# Altium schematic sheet supply0.SchDoc: foxBMS BMS-Master
size A3; DocumentNumber: 2; SheetNumber: 2; SheetTotal: 24; Author: Fraunhofer IISB foxBMS Team; REL-DATE: 2017-05-16; VERSION: 1.0.2; SheetDescription: Supply for MCU0 and peripherals
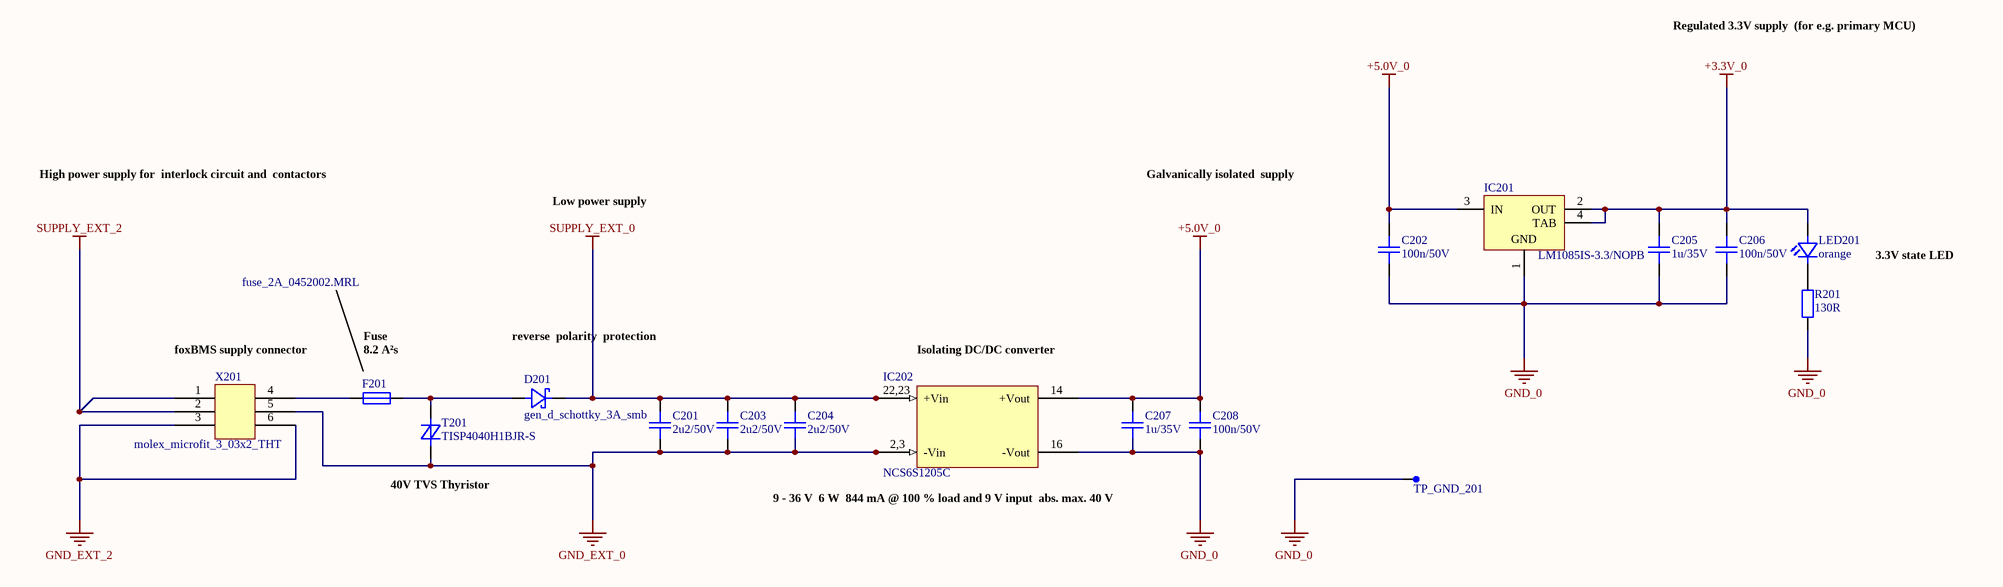
[diagram p0: supply0.SchDoc]

## Parts
C201  2u2/50V  [CAPC2012X14N]
C202  100n/50V  [CAPC1608X08N]
C203  2u2/50V  [CAPC2012X14N]
C204  2u2/50V  [CAPC2012X14N]
C205  1u/35V  [CAPC1608X08N]
C206  100n/50V  [CAPC1608X08N]
C207  1u/35V  [CAPC1608X08N]
C208  100n/50V  [CAPC1608X08N]
D201  gen_d_schottky_3A_smb  [SMB]
F201  fuse_2A_0452002.MRL  [LITTLEFUSE_452_454]
IC201  LM1085IS-3.3/NOPB  [KTT0003B_N]
IC202  NCS6S1205C  [NCS6S1205C]
LED201  orange  [LEDC1608X07N]
R201  130R  [RESC1608X05N]
T201  TISP4040H1BJR-S  [SMB]
TP_GND_201  Testpoint_Round  [Testpoint_D1V]  (value not drawn)  (no BOM)
X201  molex_microfit_3_03x2_THT  [MOLEX_MICROFIT_03x2_THT]

## Nets
+3.3V_0: C205.1 C206.1 IC201.2(OUT) IC201.4(TAB) LED201.2(A)
+5.0V_0: C202.1 C207.1 C208.1 IC201.3(IN) IC202.14(+Vout)
GND_0: C202.2 C205.2 C206.2 C207.2 C208.2 IC201.1(GND) IC202.16(-Vout) R201.1 TP_GND_201.1
GND_EXT_0: C201.2 C203.2 C204.2 IC202.2(-Vin) IC202.3(-Vin) T201.2(T(A)) X201.5
GND_EXT_2: X201.3 X201.6
SUPPLY_EXT_0: C201.1 C203.1 C204.1 D201.1(K) IC202.22(+Vin) IC202.23(+Vin)
SUPPLY_EXT_2: X201.1 X201.2
NetD201_2: D201.2(A) F201.2 T201.1(R(B))
NetF201_1: F201.1 X201.4
NetLED201_1: LED201.1(C) R201.2

## Notes on the sheet
- Regulated 3.3V supply
  (for e.g. primary MCU)
- High power supply for
  interlock circuit and
  contactors
- Galvanically isolated
  supply
- Low power supply
- 3.3V state LED
- foxBMS supply connector
- Fuse
- (near F201) 8.2 A²s
- reverse
  polarity
  protection
- (near IC202) Isolating DC/DC converter
- (near T201) 40V TVS Thyristor
- 9 - 36 V
  6 W
  844 mA @ 100 % load and 9 V input
  abs. max. 40 V
- Fraunhofer IISB
- Schottkystr. 10
- developed by:
- 91058 Erlangen
- Germany
- Author
- Project
- License
- Description
- File
- Version
- Release Date
- Sheet
- www.foxbms.org
- www.iisb.fraunhofer.de
- foxBMS Team
- /
- (in symbol NCS6S1205C) 22,23; 2,3

## Library data of the parts
C201 C203 C204 = gen_C_ceramic_2u2_50V_X7R_0805: MLCC; Capacitance: 2u2; Rated Voltage: 50V; Dielectric: X7R; Case EIA: 0805; Case Metric: 2012; Automotive Qualified: False; Part Number: gen_C_ceramic_2u2_50V_X7R_0805; Supplier 1: Farnell; Supplier Part Number 1: 2547054
C202 C206 C208 = gen_C_ceramic_100n_50V_X7R_0603: MLCC; Capacitance: 100n; Rated Voltage: 50V; Dielectric: X7R; Case EIA: 0603; Case Metric: 1608; PnP Package: C_0603_10; PnP Value: 100n/50V/X7R; PnP equipped: x; Automotive Qualified: False; Part Number: gen_C_ceramic_100n_50V_X7R_0603; Supplier 1: Farnell; Supplier Part Number 1: 2525267; Supplier 2: Digikey; Supplier Part Number 2: 490-6049-1-ND
C205 C207 = gen_C_ceramic_1u_35V_X7R_0603: MLCC; Capacitance: 1u; Rated Voltage: 35V; Dielectric: X7R; Case EIA: 0603; Case Metric: 1608; PnP Package: C_0603_10; PnP Value: 1uF/35V/X7R; PnP equipped: x; Automotive Qualified: False; Part Number: gen_C_ceramic_1u_35V_X7R_0603; Supplier 1: Farnell; Supplier Part Number 1: 1907508
D201 = gen_d_schottky_3A_smb: Schottky Diode; Part Name: e.g. STPS3L60U; Manufacturer: e.g. ST Microelectronics; Continuous Forward Current: 3A; Automotive Qualified: False; Part Number: gen_d_schottky_3A_smb; ComponentLink1Description: Datasheet; ComponentLink1URL: http://www.farnell.com/datasheets/1671123.pdf; Supplier 1: Farnell; Supplier Part Number 1: 9907769
F201 = fuse_2A_0452002.MRL: Littlefuse NANO SLO-BLO Fuse 2A 8.20A²s 0452002.MRL; Automotive Qualified: False; Part Number: fuse_2A_0452002.MRL; Manufacturer: Littlefuse; Operating Temperature: -55°C - +125°C; ComponentLink1Description: Datasheet; ComponentLink1URL: http://www.farnell.com/datasheets/2108446.pdf; Supplier 1: Farnell; Supplier Part Number 1: 2383284
IC201 = CMP-0062-00578-5: 3A Low Dropout Positive Regulators, 3-pin TO-263, Pb-Free; Manufacturer: Texas Instruments; High-Reliability: Y; PowerWise: N; CompType: LDO IC; PackageTopMarking: NSUZXYTTE#*LM1085*IS-3.3; PartNumber: LM1085IS-3.3/NOPB; ComponentLink1Description: Datasheet URL; Code_JEDEC: MO-169-AA; PinCount: 3; RoHS: Y; PackageReference: KTT0003B; ComponentLink1URL: http://www.ti.com/general/docs/lit/getliterature.tsp?genericPartNumber=LM1085&fileType=pdf; PackageDescription: TO-263, Molded, .400 x .390 x .180in, 3 Lead, .1in Pitch, Surface Mount
IC202 = NCS6S1205C: Murata Isolated 6W 4:1 Input Single Output DC/DC Converter; Manufacturer: Murata Power Solutions Inc.; Automotive Qualified: False; Part Number: NCS6S1205C; Operating Temperature: -40°C - +85°C; ComponentLink1Description: Datasheet; ComponentLink1URL: https://power.murata.com/data/power/ncl/kdc_ncs6.pdf; ComponentLink2Description: 3D PDF; ComponentLink2URL: https://power.murata.com/3d/dcdc/mps_dcdc_ncs6s_a.pdf; Supplier 1: Digikey; Supplier Part Number 1: 811-2109-5-ND
LED201 = gen_LED_0603_orange: LED; Breakdown Voltage: 5V; Continuous Forward Current: 20mA; Forward Voltage @ 20mA: 2.2V; Automotive Qualified: False; Part Number: gen_LED_0603_orange; Color: orange; PnP Package: LED_0603; Supplier 1: Farnell; Supplier Part Number 1: 2099222
R201 = gen_R_130R_0603: SMD Resistor 130R 0603; Tolerance: 1%; Power: 0.1W; Case EIA: 0603; Case Metric: 1608; Maximum Working Voltage: 75V; PnP Package: R_0603; Automotive Qualified: False; Part Number: gen_R_130R_0603; Operating Temperature: -55°C - +155°C; Resistance: 130R; Series: E24, E96; PnP Value: 130R; Supplier 1: Farnell; Supplier Part Number 1: 2379959
T201 = TISP4040H1BJR-S: BIDIRECTIONAL THYRISTOR OVERVOLTAGE PROTECTOR; Manufacturer: Bourns; Automotive Qualified: False; Part Number: TISP4040H1BJR-S; Operating Temperature: -40°C - +150°C; ComponentLink1Description: Datasheet; ComponentLink1URL: http://www.bourns.com/data/global/pdfs/TISP40xxH1BJ.pdf; Supplier 1: Digikey; Supplier Part Number 1: TISP4040H1BJR-SCT-ND
TP_GND_201 = Testpoint_Round_Via: Testpoint, Via, round; Part Number: Testpoint_Round_Via
X201 = molex_microfit_3_03x2_THT: Micro-Fit 3.0 Right Angle Header, 3.00mm Pitch, Dual Row, 6 Circuits, with Snap-in Plastic Peg PCB Lock, Tin, Glow Wire Capable, Black, 43045-0600; Manufacturer: Molex; Circuits: 6; Rated Voltage: 600V; Rated Current: 8.5A; Automotive Qualified: False; Part Number: molex_microfit_3_03x2_THT; Part Name: MicroFit; Operating Temperature: -40°C - +105°C; Supplier 1: Farnell; Supplier Part Number 1: 1012252